# Altium project JTAGconv.PrjPcb
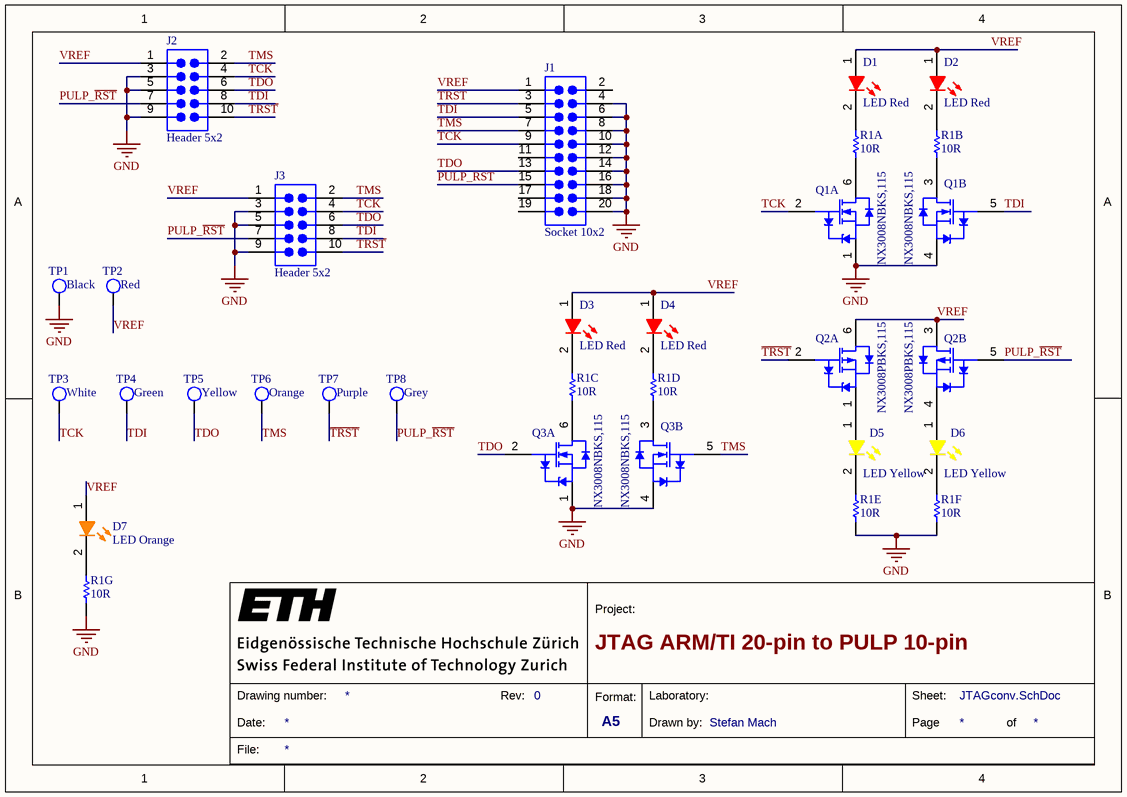
[diagram p0: JTAGconv.SchDoc]
ProjectVersion: 1.; Project Name: JTAG Plug Converter; ProjectFlavor: 1; OutFilePrefix: JTAGconv; Laboratory: Integrated Systems Laboratory (IIS); DrawnBy: Stefan Mach
1 sheet, 24 parts. Net scope: global (net labels, ports and power ports of the same name join across sheets).
Board file: JTAGconv.PcbDoc

## Sheet JTAGconv.SchDoc: JTAG ARM/TI 20-pin to PULP 10-pin
size 210 x 148 mm; DrawnBy: Stefan Mach; Organization: Integrated Systems Laboratory (IIS); Revision: 0; ProjectName: JTAG Plug Converter

### Parts
(Parts that share a designator on the sheet are numbered #1, #2 ... from top to bottom, then left to right.)
D1  LED Red  [DIOC2112X08L]
D2  LED Red  [DIOC2112X08L]
D3  LED Red  [DIOC2112X08L]
D4  LED Red  [DIOC2112X08L]
D5  LED Yellow  [DIOC2112X08L]
D6  LED Yellow  [DIOC2112X08L]
D7  LED Orange  [DIOC2112X08L]
J1  Socket 10x2  [CONN_SOCKET_10x2_RA]
J2  Header 5x2  [CONN_HDR_5x2_SHRD]
J3  Header 5x2  [CONN_HDR_5x2_50mil_SHRD]
Q1#1  NX3008NBKS,115  [NXP-SOT363_L]  (part A of 2)
Q1#2  NX3008NBKS,115  [NXP-SOT363_L]  (part B of 2)
Q2  NX3008PBKS,115  [NXP-SOT363_L]  (parts A,B of 2)
Q3#1  NX3008NBKS,115  [NXP-SOT363_L]  (part A of 2)
Q3#2  NX3008NBKS,115  [NXP-SOT363_L]  (part B of 2)
R1  10R  [CAC-80P639X159-16L]  (parts A,B,C,D,E,F,G of 8)
TP1  (no value)  [KEYSTONE-5001]
TP2  (no value)  [KEYSTONE-5000]
TP3  (no value)  [KEYSTONE-5002]
TP4  (no value)  [KEYSTONE-5116]
TP5  (no value)  [KEYSTONE-5004]
TP6  (no value)  [KEYSTONE-5003]
TP7  (no value)  [KEYSTONE-5119]
TP8  (no value)  [KEYSTONE-5118]

### Nets
GND: J1.4 J1.6 J1.8 J1.10 J1.12 J1.14 J1.16 J1.18 J1.20 J2.3 J2.5 J2.9 J3.3 J3.5 J3.9 Q1#1.1(S1) Q1#2.4(S2) Q3#1.1(S1) Q3#2.4(S2) R1.5 R1.6 R1.7 TP1.1
PULP_~{RST}: J1.15 J2.7 J3.7 Q2.5(G2) TP8.1
~{TRST}: J1.3 J2.10 J3.10 Q2.2(G1) TP7.1
TCK: J1.9 J2.4 J3.4 Q1#1.2(G1) TP3.1
TDI: J1.5 J2.8 J3.8 Q1#2.5(G2) TP4.1
TDO: J1.13 J2.6 J3.6 Q3#1.2(G1) TP5.1
TMS: J1.7 J2.2 J3.2 Q3#2.5(G2) TP6.1
VREF: D1.1(A) D2.1(A) D3.1(A) D4.1(A) D7.1(A) J1.1 J2.1 J3.1 Q2.3(D2) Q2.6(D1) TP2.1
NetD1_2: D1.2(K) R1.16
NetD2_2: D2.2(K) R1.15
NetD3_2: D3.2(K) R1.14
NetD4_2: D4.2(K) R1.13
NetD5_1: D5.1(A) Q2.1(S1)
NetD5_2: D5.2(K) R1.12
NetD6_1: D6.1(A) Q2.4(S2)
NetD6_2: D6.2(K) R1.11
NetD7_2: D7.2(K) R1.10
NetQ1#1_6: Q1#1.6(D1) R1.1
NetQ1#2_3: Q1#2.3(D2) R1.2
NetQ3#1_6: Q3#1.6(D1) R1.3
NetQ3#2_3: Q3#2.3(D2) R1.4

Not connected (* = marked no-connect by the designer): J1 2 11(2) 17(8) 19(10)

### Notes on the sheet
- Project:
- File:
- Date:
- Drawing number:
- Rev:
- Format:
- A5
- Drawn by:
- Laboratory:
- Page
- Sheet:
- of

### Library data of the parts
D1-D4 = ROHM-LED-RED-SML-211UTT86: Red LED, 0805 SMD, 2mA, 1.8V; Manufacturer: Rohm; Lens Colour: Colorless; Lens Style: Diffused,Colorless; Dominant Wavelength: 620nm; Luminous Intensity: 2.5mcd; Wavelength: 630nm; Number of LEDs: 1; Viewing Angle: 140°; Lens Transparency: Clear; Supplier 1: Digikey; Supplier Part Number 1: 511-1292-2-ND; Manufacturer Part Number: SML-211UTT86; Stock 1: 93000; Pricing 1: 3000=0.1073, 6000=0.0975, 15000=0.091, 30000=0.0878, 75000=0.0845 (USD); Mount: Surface Mount; Case/Package: 0805; Number of Pins: 2; Colour: Red; Case Code (Metric): 2012; Case Code (Imperial): 0805; Min Operating Temperature: -30°C; Max Operating Temperature: 85°C; Packaging: Tape and Reel; Forward Voltage: 1.8V; Forward Current: 2mA; Package Quantity: 3000; Illumination Colour: Red; Test Current: 2mA; Length: 2mm; Height: 0.9mm; Width: 1.25mm; Radiation Hardening: No; Lead Free: Lead Free; ComponentLink1URL: https://datasheet.ciiva.com/11774/0900766b80df3a3e-11774129.pdf; ComponentLink1Description: https://datasheet.ciiva.com/11774/0900766b80df3a3e-11774129.pdf; ComponentLink2URL: https://datasheet.ciiva.com/2115/sml-21-2115075.pdf; ComponentLink2Description: https://datasheet.ciiva.com/2115/sml-21-2115075.pdf; ComponentLink3URL: https://datasheet.ciiva.com/16293/sml-211ytt86-16293295.pdf; ComponentLink3Description: https://datasheet.ciiva.com/16293/sml-211ytt86-16293295.pdf; ComponentLink4URL: https://datasheet.ciiva.com/2115/sml-21-2115073.pdf; ComponentLink4Description: https://datasheet.ciiva.com/2115/sml-21-2115073.pdf; ComponentLink5URL: https://datasheet.ciiva.com/2115/sml-21-2115074.pdf; ComponentLink5Description: https://datasheet.ciiva.com/2115/sml-21-2115074.pdf; Supplier 2: Digikey; Supplier Part Number 2: 511-1292-6-ND; Stock 2: 94293; Pricing 2: 1=0.49, 10=0.35, 25=0.286, 100=0.2288, 250=0.193, 500=0.1645, 1000=0.1287 (USD); Supplier 3: RS Components; Supplier Part Number 3: 7007907; Stock 3: 4280; Pricing 3: 5=0.328, 25=0.24, 100=0.144, 250=0.142, 500=0.138 (EUR); Supplier 4: Digikey; Supplier Part Number 4: 511-1292-1-ND; Stock 4: 94293; Pricing 4: 1=0.49, 10=0.35, 25=0.286, 100=0.2288, 250=0.193, 500=0.1645, 1000=0.1287 (USD); Supplier 5: Verical; Supplier Part Number 5: SML-211UTT86; Stock 5: 3373; Pricing 5: 70=0.3839, 100=0.2371, 500=0.2101, 1000=0.1859 (USD); Supplier 6: Chip One Stop Japan; Supplier Part Number 6: C1S625900634159; Stock 6: 3373; Pricing 6: 10=57.8, 50=41, 100=35.7, 500=19.5, 1000=15.1, 3000=14.7, 10=0.287, 50=0.285, 100=0.176, 500=0.156, 1000=0.138, 3000=0.134, 10=2.59, 100=1.4, 1000=1.1, 3000=1.07 (JPY); Supplier 7: Future Electronics; Supplier Part Number 7: 7057434; Stock 7: 3000; Pricing 7: 3000=0.104 (USD); Supplier 8: Mouser; Supplier Part Number 8: 755-SML-211UTT86; Stock 8: 8950; Pricing 8: 1=0.38, 10=0.288, 50=0.288, 100=0.156, 1000=0.117, 10000=0.095 (USD); Supplier 9: Avnet Europe; Supplier Part Number 9: SML-211UTT86; Stock 9: 0; Pricing 9: 3000=0.2086, 6000=0.1622, 12000=0.1327, 18000=0.1123, 30000=0.1043 (EUR); Supplier 10: Chip One Stop Global; Supplier Part Number 10: C1S625900634159; Stock 10: 3000; Pricing 10: 50=89.3, 500=84.8, 1000=78.8, 50=0.834, 500=0.792, 1000=0.736, 50=6.65, 500=6.31, 1000=5.86 (JPY); Supplier 11: Future Electronics; Supplier Part Number 11: 6473904; Stock 11: 0; Pricing 11: 3000=0.0898, 9000=0.0869 (USD); Supplier 12: Future Electronics; Supplier Part Number 12: 5988308; Stock 12: 0; Pricing 12: 1=0.1, 400=0.0975 (USD); Supplier 13: Allied Electronics; Supplier Part Number 13: 70522030; Stock 13: 5; Pricing 13: 1=0.67, 100=0.59, 250=0.53, 500=0.49 (USD); Supplier 14: Avnet; Supplier Part Number 14: SML-211UTT86; Stock 14: 0; Pricing 14: 3000=0.1029, 6000=0.0964, 12000=0.0908, 18000=0.0858, 30000=0.0834 (USD); Supplier 15: Avnet Asia; Supplier Part Number 15: SML-211UTT86; Stock 15: 0; Pricing 15: 3000=0.1051, 6000=0.0956, 12000=0.0924, 18000=0.0892, 30000=0.088 (USD); Supplier 16: LTL Group; Supplier Part Number 16: SML-211UTT86; Stock 16: 2800; Supplier 17: Quest; Supplier Part Number 17: SML-211UTT86; Stock 17: 2840; Supplier 18: Future Electronics; Supplier Part Number 18: SML-211UTT86; Stock 18: 0; Pricing 18: 3000=0.104, 6000=0.0956, 9000=0.0936 (USD); Supplier 19: Farnell; Supplier Part Number 19: 1685056; Stock 19: 0; Pricing 19: 1=0.688, 10=0.319, 100=0.238, 250=0.209, 500=0.188, 2000=0.167, 4000=0.15, 20000=0.131 (EUR); REACH SVHC: No SVHC; ComponentLink6URL: https://datasheet.ciiva.com/8028/1694508-8028242.pdf; ComponentLink6Description: https://datasheet.ciiva.com/8028/1694508-8028242.pdf; Supplier 20: element14 APAC; Supplier Part Number 20: 1685056; Stock 20: 102; Supplier 21: Newark; Supplier Part Number 21: 40P3314; Stock 21: 0; Supplier 22: Epart123; Supplier Part Number 22: SML-211UTT86K; Stock 22: 6000; Pricing 22: 3000=0.072, 10000=0.072 (USD); Supplier 23: Farnell; Supplier Part Number 23: 1685056RL; Stock 23: 15873; Pricing 23: 1=0.43, 100=0.189, 2000=0.0918, 4000=0.0826, 20000=0.0744 (GBP)
D5 D6 = ROHM-LED-YELLOW-SML-211YTT86: Yellow LED, 0805 SMD, 2mA, 1.8V; Manufacturer: Rohm; Manufacturer Part Number: SML-211UTT86; Colour: Red; Lens Colour: Colorless; Lens Style: Diffused,Colorless; Dominant Wavelength: 620nm; Luminous Intensity: 2.5mcd; Wavelength: 630nm; Number of LEDs: 1; Viewing Angle: 140°; Lens Transparency: Clear; Mount: Surface Mount; Case/Package: 0805; Number of Pins: 2; Case Code (Metric): 2012; Case Code (Imperial): 0805; Min Operating Temperature: -30°C; Max Operating Temperature: 85°C; Packaging: Tape and Reel; Forward Voltage: 1.8V; Forward Current: 2mA; Package Quantity: 3000; Illumination Colour: Red; Test Current: 2mA; Length: 2mm; Height: 0.9mm; Width: 1.25mm; Radiation Hardening: No; Lead Free: Lead Free; ComponentLink1URL: https://datasheet.ciiva.com/11774/0900766b80df3a3e-11774129.pdf; ComponentLink1Description: https://datasheet.ciiva.com/11774/0900766b80df3a3e-11774129.pdf; ComponentLink2URL: https://datasheet.ciiva.com/2115/sml-21-2115075.pdf; ComponentLink2Description: https://datasheet.ciiva.com/2115/sml-21-2115075.pdf; ComponentLink3URL: https://datasheet.ciiva.com/16293/sml-211ytt86-16293295.pdf; ComponentLink3Description: https://datasheet.ciiva.com/16293/sml-211ytt86-16293295.pdf; ComponentLink4URL: https://datasheet.ciiva.com/2115/sml-21-2115073.pdf; ComponentLink4Description: https://datasheet.ciiva.com/2115/sml-21-2115073.pdf; ComponentLink5URL: https://datasheet.ciiva.com/2115/sml-21-2115074.pdf; ComponentLink5Description: https://datasheet.ciiva.com/2115/sml-21-2115074.pdf; REACH SVHC: No SVHC; ComponentLink6URL: https://datasheet.ciiva.com/8028/1694508-8028242.pdf; ComponentLink6Description: https://datasheet.ciiva.com/8028/1694508-8028242.pdf; Supplier 1: Digikey; Supplier Part Number 1: 511-1293-2-ND; Stock 1: 12000; Pricing 1: 3000=0.1073, 6000=0.0975, 15000=0.091, 30000=0.0878, 75000=0.0845 (USD); ComponentLink7URL: https://datasheet.ciiva.com/11774/0900766b80df3a3e-11774886.pdf; ComponentLink7Description: https://datasheet.ciiva.com/11774/0900766b80df3a3e-11774886.pdf; ComponentLink8URL: https://datasheet.ciiva.com/16392/sml-211ytt86-16392987.pdf; ComponentLink8Description: https://datasheet.ciiva.com/16392/sml-211ytt86-16392987.pdf; ComponentLink9URL: https://datasheet.ciiva.com/2111/sml-21-2111285.pdf; ComponentLink9Description: https://datasheet.ciiva.com/2111/sml-21-2111285.pdf; ComponentLink10URL: https://datasheet.ciiva.com/2111/sml-21-2111283.pdf; ComponentLink10Description: https://datasheet.ciiva.com/2111/sml-21-2111283.pdf; ComponentLink11URL: https://datasheet.ciiva.com/2111/sml-21-2111284.pdf; ComponentLink11Description: https://datasheet.ciiva.com/2111/sml-21-2111284.pdf; Supplier 2: Digikey; Supplier Part Number 2: 511-1293-6-ND; Stock 2: 13553; Pricing 2: 1=0.49, 10=0.35, 25=0.286, 100=0.2288, 250=0.193, 500=0.1645, 1000=0.1287 (USD); Supplier 3: Farnell; Supplier Part Number 3: 1685057RL; Stock 3: 12289; Pricing 3: 900=0.0963, 3000=0.0922, 9000=0.0904 (GBP); ComponentLink12URL: https://datasheet.ciiva.com/8028/90860-8028248.pdf; ComponentLink12Description: https://datasheet.ciiva.com/8028/90860-8028248.pdf; ComponentLink13URL: https://datasheet.ciiva.com/8028/90860-8028245.pdf; ComponentLink13Description: https://datasheet.ciiva.com/8028/90860-8028245.pdf; Supplier 4: element14 APAC; Supplier Part Number 4: 1685057; Stock 4: 60; Supplier 5: Newark; Supplier Part Number 5: 40P3315; Stock 5: 0; Supplier 6: Avnet Europe; Supplier Part Number 6: SML211YTT86K; Stock 6: 0; Supplier 7: Farnell; Supplier Part Number 7: 1685057; Stock 7: 0; Pricing 7: 1=1.07, 10=0.502, 100=0.369, 250=0.327, 500=0.291, 900=0.261, 3000=0.232, 9000=0.206 (EUR); Supplier 8: Future Electronics; Supplier Part Number 8: SML-211YTT86; Stock 8: 6000; Pricing 8: 3000=0.104, 6000=0.0956, 9000=0.0936 (USD); Supplier 9: Quest; Supplier Part Number 9: SML-211YTT86; Stock 9: 2989; Pricing 9: 1=0.276, 19=0.207, 49=0.1725, 291=0.138, 1450=0.1035 (USD); Supplier 10: LTL Group; Supplier Part Number 10: SML-211YTT86; Stock 10: 0; Pricing 10: 2238=2238 (USD); Supplier 11: Avnet; Supplier Part Number 11: SML-211YTT86; Stock 11: 0; Pricing 11: 3000=0.1029, 6000=0.0964, 12000=0.0908, 18000=0.0858, 30000=0.0834 (USD); Supplier 12: Future Electronics; Supplier Part Number 12: 8894297; Stock 12: 0; Pricing 12: 1=0.1, 400=0.0975 (USD); Supplier 13: Future Electronics; Supplier Part Number 13: 6809040; Stock 13: 0; Pricing 13: 3000=0.0898, 9000=0.0869 (USD); Supplier 14: Avnet Europe; Supplier Part Number 14: SML-211YTT86; Stock 14: 0; Pricing 14: 3000=0.2086, 6000=0.1622, 12000=0.1327, 18000=0.1123, 30000=0.1043 (EUR); Supplier 15: Chip One Stop Global; Supplier Part Number 15: C1S625900634186; Stock 15: 3000; Pricing 15: 50=89.3, 500=84.8, 1000=78.8, 50=0.834, 500=0.792, 1000=0.736, 50=6.65, 500=6.31, 1000=5.86 (JPY); Supplier 16: Chip One Stop Japan; Supplier Part Number 16: C1S625900634186; Stock 16: 11890; Pricing 16: 10=33.1, 50=32.2, 100=25.8, 500=18.5, 1000=15.1, 3000=14.7, 10=0.272, 50=0.27, 100=0.176, 500=0.155, 1000=0.138, 3000=0.134, 10=2.46, 50=2.26, 100=1.39, 500=1.29, 1000=1.1, 3000=1.07 (JPY); Supplier 17: Mouser; Supplier Part Number 17: 755-SML-211YTT86; Stock 17: 2680; Pricing 17: 1=0.38, 10=0.288, 50=0.288, 100=0.156, 1000=0.117, 10000=0.095 (USD); Supplier 18: Digikey; Supplier Part Number 18: 511-1293-1-ND; Stock 18: 13553; Pricing 18: 1=0.49, 10=0.35, 25=0.286, 100=0.2288, 250=0.193, 500=0.1645, 1000=0.1287 (USD); Supplier 19: Verical; Supplier Part Number 19: SML-211YTT86; Stock 19: 11890; Pricing 19: 74=0.3622, 100=0.2361, 500=0.208, 1000=0.1851 (USD); Supplier 20: RS Components; Supplier Part Number 20: 7007900; Stock 20: 1739; Pricing 20: 5=0.318, 25=0.232, 100=0.14, 250=0.138, 500=0.134 (EUR)
D7 = ROHM-LED-ORANGE-SML-211DTT86: Orange LED, 0805 SMD, 2mA, 1.8V; Manufacturer: Rohm; Manufacturer Part Number: SML-211UTT86; Colour: Red; Lens Colour: Colorless; Lens Style: Diffused,Colorless; Dominant Wavelength: 620nm; Luminous Intensity: 2.5mcd; Wavelength: 630nm; Number of LEDs: 1; Viewing Angle: 140°; Lens Transparency: Clear; Mount: Surface Mount; Case/Package: 0805; Number of Pins: 2; Case Code (Metric): 2012; Case Code (Imperial): 0805; Min Operating Temperature: -30°C; Max Operating Temperature: 85°C; Packaging: Tape and Reel; Forward Voltage: 1.8V; Forward Current: 2mA; Package Quantity: 3000; Illumination Colour: Red; Test Current: 2mA; Length: 2mm; Height: 0.9mm; Width: 1.25mm; Radiation Hardening: No; Lead Free: Lead Free; ComponentLink1URL: https://datasheet.ciiva.com/11774/0900766b80df3a3e-11774129.pdf; ComponentLink1Description: https://datasheet.ciiva.com/11774/0900766b80df3a3e-11774129.pdf; ComponentLink2URL: https://datasheet.ciiva.com/2115/sml-21-2115075.pdf; ComponentLink2Description: https://datasheet.ciiva.com/2115/sml-21-2115075.pdf; ComponentLink3URL: https://datasheet.ciiva.com/16293/sml-211ytt86-16293295.pdf; ComponentLink3Description: https://datasheet.ciiva.com/16293/sml-211ytt86-16293295.pdf; ComponentLink4URL: https://datasheet.ciiva.com/2115/sml-21-2115073.pdf; ComponentLink4Description: https://datasheet.ciiva.com/2115/sml-21-2115073.pdf; ComponentLink5URL: https://datasheet.ciiva.com/2115/sml-21-2115074.pdf; ComponentLink5Description: https://datasheet.ciiva.com/2115/sml-21-2115074.pdf; REACH SVHC: No SVHC; ComponentLink6URL: https://datasheet.ciiva.com/8028/1694508-8028242.pdf; ComponentLink6Description: https://datasheet.ciiva.com/8028/1694508-8028242.pdf; ComponentLink7URL: https://datasheet.ciiva.com/11774/0900766b80df3a3e-11774886.pdf; ComponentLink7Description: https://datasheet.ciiva.com/11774/0900766b80df3a3e-11774886.pdf; ComponentLink8URL: https://datasheet.ciiva.com/16392/sml-211ytt86-16392987.pdf; ComponentLink8Description: https://datasheet.ciiva.com/16392/sml-211ytt86-16392987.pdf; ComponentLink9URL: https://datasheet.ciiva.com/2111/sml-21-2111285.pdf; ComponentLink9Description: https://datasheet.ciiva.com/2111/sml-21-2111285.pdf; ComponentLink10URL: https://datasheet.ciiva.com/2111/sml-21-2111283.pdf; ComponentLink10Description: https://datasheet.ciiva.com/2111/sml-21-2111283.pdf; ComponentLink11URL: https://datasheet.ciiva.com/2111/sml-21-2111284.pdf; ComponentLink11Description: https://datasheet.ciiva.com/2111/sml-21-2111284.pdf; ComponentLink12URL: https://datasheet.ciiva.com/8028/90860-8028248.pdf; ComponentLink12Description: https://datasheet.ciiva.com/8028/90860-8028248.pdf; ComponentLink13URL: https://datasheet.ciiva.com/8028/90860-8028245.pdf; ComponentLink13Description: https://datasheet.ciiva.com/8028/90860-8028245.pdf; Supplier 1: Avnet; Supplier Part Number 1: SML-211DTT86K; Stock 1: 0; ComponentLink14URL: https://datasheet.ciiva.com/8028/90860-8028240.pdf; ComponentLink14Description: https://datasheet.ciiva.com/8028/90860-8028240.pdf; ComponentLink15URL: https://datasheet.ciiva.com/8028/90860-8028237.pdf; ComponentLink15Description: https://datasheet.ciiva.com/8028/90860-8028237.pdf; Supplier 2: Digikey; Supplier Part Number 2: 511-1291-2-ND; Stock 2: 33000; Pricing 2: 3000=0.1073, 6000=0.0975, 15000=0.091, 30000=0.0878, 75000=0.0845 (USD); ComponentLink16URL: https://datasheet.ciiva.com/16219/sml-211ytt86-16219080.pdf; ComponentLink16Description: https://datasheet.ciiva.com/16219/sml-211ytt86-16219080.pdf; ComponentLink17URL: https://datasheet.ciiva.com/11773/0900766b80df3a3e-11773627.pdf; ComponentLink17Description: https://datasheet.ciiva.com/11773/0900766b80df3a3e-11773627.pdf; ComponentLink18URL: https://datasheet.ciiva.com/2111/sml-21-2111286.pdf; ComponentLink18Description: https://datasheet.ciiva.com/2111/sml-21-2111286.pdf; ComponentLink19URL: https://datasheet.ciiva.com/2111/sml-21-2111287.pdf; ComponentLink19Description: https://datasheet.ciiva.com/2111/sml-21-2111287.pdf; ComponentLink20URL: https://datasheet.ciiva.com/2111/sml-21-2111288.pdf; ComponentLink20Description: https://datasheet.ciiva.com/2111/sml-21-2111288.pdf; Supplier 3: Avnet; Supplier Part Number 3: SML-211DTT86; Stock 3: 0; Pricing 3: 3000=0.1029, 6000=0.0964, 12000=0.0908, 18000=0.0858, 30000=0.0834 (USD); Supplier 4: Allied Electronics; Supplier Part Number 4: 70522027; Stock 4: 50; Pricing 4: 1=0.42, 200=0.37, 500=0.33, 1000=0.31 (USD); Supplier 5: Quest; Supplier Part Number 5: SML-211DTT86; Stock 5: 587; Supplier 6: Newark; Supplier Part Number 6: 40P3313; Stock 6: 1089; Pricing 6: 1=0.391, 10=0.289, 100=0.248, 250=0.214, 500=0.184, 1000=0.143, 2500=0.127, 5000=0.107 (USD); Supplier 7: Farnell; Supplier Part Number 7: 1685055RL; Stock 7: 6606; Pricing 7: 1=0.38, 10=0.222, 100=0.163, 2000=0.0792, 4000=0.0713, 20000=0.0642 (GBP); Supplier 8: Future Electronics; Supplier Part Number 8: SML-211DTT86; Stock 8: 0; Pricing 8: 3000=0.104, 6000=0.0956, 9000=0.0936 (USD); Supplier 9: Digikey; Supplier Part Number 9: 511-1291-1-ND; Stock 9: 34587; Pricing 9: 1=0.49, 10=0.35, 25=0.286, 100=0.2288, 250=0.193, 500=0.1645, 1000=0.1287 (USD); Supplier 10: RS Components; Supplier Part Number 10: 7007897; Stock 10: 1709; Pricing 10: 10=0.245, 50=0.196, 200=0.145, 500=0.122, 1000=0.113 (EUR); Supplier 11: Digikey; Supplier Part Number 11: 511-1291-6-ND; Stock 11: 34587; Pricing 11: 1=0.49, 10=0.35, 25=0.286, 100=0.2288, 250=0.193, 500=0.1645, 1000=0.1287 (USD); Supplier 12: Verical; Supplier Part Number 12: SML-211DTT86; Stock 12: 2869; Pricing 12: 70=0.3793, 100=0.2342, 500=0.2063, 1000=0.1836 (USD); Supplier 13: Chip One Stop Japan; Supplier Part Number 13: C1S625900507174; Stock 13: 2869; Pricing 13: 10=41.7, 50=34, 100=29.5, 500=25.3, 1000=23.1, 10=0.287, 50=0.285, 100=0.176, 500=0.156, 1000=0.138, 10=2.91, 50=2.38, 100=1.9, 500=1.36, 1000=1.1 (JPY); Supplier 14: Mouser; Supplier Part Number 14: 755-SML-211DTT86; Stock 14: 0; Pricing 14: 1=0.38, 10=0.288, 50=0.288, 100=0.156, 1000=0.117, 10000=0.095 (USD); Supplier 15: Future Electronics; Supplier Part Number 15: 6940829; Stock 15: 0; Pricing 15: 1=0.1, 400=0.0975 (USD); Supplier 16: Avnet Europe; Supplier Part Number 16: SML-211DTT86; Stock 16: 0; Supplier 17: Future Electronics; Supplier Part Number 17: 7062953; Stock 17: 0; Pricing 17: 3000=0.0898, 9000=0.0869 (USD); Supplier 18: Avnet Asia; Supplier Part Number 18: SML-211DTT86; Stock 18: 0; Pricing 18: 3000=0.1029 (USD); Supplier 19: SPEC; Supplier Part Number 19: SML-211DTT86; Stock 19: 2900; Supplier 20: Farnell; Supplier Part Number 20: 1685055; Stock 20: 0; Pricing 20: 1=0.722, 10=0.333, 100=0.245, 250=0.213, 500=0.191, 2000=0.17, 4000=0.153, 20000=0.134 (EUR); Supplier 21: element14 APAC; Supplier Part Number 21: 1685055; Stock 21: 0
J1 = CONN-SOCKET-F-10x2-RA: Female Socket, 10x2, Pitch 2.54mm, 20-Pin, Right-Angle; Manufacturer: Sullins; Manufacturer Part Number: SFH11-PBPC-D10-RA-BK; Number of Positions: 20; Connector Type: Socket,Header; Pitch: 0.1inch; Supplier 1: Digikey; Stock 1: 3527; Pricing 1: 1=1.67, 10=1.38, 25=1.2936, 50=1.15, 100=1.035, 250=0.9545, 500=0.8625, 1000=0.7648, 2500=0.7331 (USD); Colour: Black; Contact Plating: Gold; Package Quantity: 1; Number of Rows: 2; Packaging: Tray; Termination: Solder; Row Spacing: 0.1inch; Lead Free: Lead Free; ComponentLink1URL: https://datasheet.ciiva.com/16226/sfh11-pbpc-d10-ra-bk-16226946.pdf; ComponentLink1Description: https://datasheet.ciiva.com/16226/sfh11-pbpc-d10-ra-bk-16226946.pdf; ComponentLink2URL: https://datasheet.ciiva.com/754/sfh11-pxxc-dxx-ra-xx11161-c-754566.pdf; ComponentLink2Description: https://datasheet.ciiva.com/754/sfh11-pxxc-dxx-ra-xx11161-c-754566.pdf; Supplier 2: Future Electronics; Stock 2: 0; Pricing 2: 1080=0.875 (USD); Supplier 3: Future Electronics; Stock 3: 0; Pricing 3: 10=1.5, 25=1.42, 75=1.25, 200=1.03, 500=0.875 (USD); Supplier Part Number 1: S9205-ND; Supplier Part Number 2: SFH11-PBPC-D10-RA-BK; Supplier Part Number 3: 2723161
J2 = CONN-HEADER-M-5x2-SHRD: Male Header, 5x2, Pitch 2.54mm, 10-Pin, Shrouded; Manufacturer: On-Shore Technology; Manufacturer Part Number: 302-S101; Number of Positions: 10; Connector Type: Male Pin; Pitch: 0.1inch; Colour: Black; Supplier 1: Arrow; Supplier Part Number 1: 302-S101; Stock 1: 10; Pricing 1: 1=0.252, 10=0.2343, 50=0.1686, 100=0.1605, 250=0.1426, 500=0.1346, 1000=0.111, 2500=0.1004, 5000=0.0932 (USD); Case/Package: 100; Contact Plating: Gold; Number of Rows: 2; Packaging: Tray; Termination: Solder; Row Spacing: 0.1inch; ComponentLink1URL: https://datasheet.ciiva.com/732/302-sxxx-732946.pdf; ComponentLink1Description: https://datasheet.ciiva.com/732/302-sxxx-732946.pdf; Supplier 2: Digikey; Supplier Part Number 2: ED1543-ND; Stock 2: 46867; Pricing 2: 1=0.28, 10=0.263, 50=0.1912, 100=0.1838, 250=0.165, 500=0.1575, 1000=0.1313, 2500=0.12, 5000=0.1125 (USD); Supplier 3: Peerless Electronic Supplies; Supplier Part Number 3: 302-S101; Pricing 3: 1=0.25 (USD)
J3 = CONN-HEADER-M-5x2-50mil-shrd: Male Header, 5x2, Pitch 1.27mm, 10-Pin, Shrouded; Manufacturer: CNC Tech; Manufacturer Part Number: 3220-10-0100-00; Number of Positions: 10; Connector Type: Header, Shrouded; Pitch: 0.050" (1.27mm); Minimum Quantity: Male Pin; Mating Products: 1175-1645-ND / - IDC SOCKET 0.050 10 POS / 3230-10-0102-00-ND / - IDC SOCKET 0.050 10 POS / 1175-1646-ND / - IDC SOCKET 0.050 10 POS / 3230-10-0104-00-ND / - IDC SOCKET 0.050 10 POS; Dynamic Catalog: CNC Tech, 0.050" (1.27mm); Number of Positions Loaded: All; Mating: 3230-10-0102-00-ND / - IDC SOCKET 0.050 10 POS / 1175-1645-ND / - IDC SOCKET 0.050 10 POS; Other Names: 1175-1627 / 3220-10-0100-00-ND; Supplier 1: Digikey; Supplier Part Number 1: 1175-1627-ND; Stock 1: 66468; Pricing 1: 1=0.48, 10=0.45, 50=0.36, 100=0.345, 250=0.315, 500=0.3, 1000=0.2475, 2500=0.225, 5000=0.2175 (USD); Number of Rows: 2; Packaging: Tray; Termination: Solder; Row Spacing: 0.050" (1.27mm); ComponentLink1URL: https://datasheet.ciiva.com/18655/3220-xx-0100-00-18655342.pdf; ComponentLink1Description: https://datasheet.ciiva.com/18655/3220-xx-0100-00-18655342.pdf; Supplier 2: Digikey; Supplier Part Number 2: 3220-10-0100-00-ND; Stock 2: 0; Pricing 2: 6720=0.2045 (USD); Quantity Available: Tray; Standard Package: 3,200; Category: Connectors, Interconnects; Family: Rectangular Connectors - Headers, Male Pins; Contact Type: Male Pin; Mounting Type: Through Hole; Contact Finish: Gold; Contact Finish Thickness: Flash; Online Catalog: CNC Tech, 0.050" (1.27mm)
Q1#1 Q1#2 Q3#1 Q3#2 = CMP-1259-00111-1: Dual N-Channel Trench MOSFET, 30 V, 0.35 A, -55 to 150 degC, 6-Pin SOT363, Tape and Reel; Manufacturer: NXP Semiconductors; VDS [max] (V): 30; ID [max] (A): 0.35; VGSth [typ] (V): 0.9; IDM [max] (A): 1.4; Automotive Qualified: Y; Channel Type: N; Packing: Tape & Reel; Mounting Technology: Surface Mount; ComponentLink3Description: Package Specification; ComponentLink2URL: http://www.nxp.com/documents/data_sheet/NX3008NBKS.pdf; DatasheetVersion: Rev. 1; ComponentLink2Description: Datasheet; Code_JEITA: SC-88; PackageReference: SOT363; PackageVersion: 06-03-16, 03/2006; ComponentLink1URL: http://www.nxp.com/; ComponentLink3URL: http://www.nxp.com/documents/outline_drawing/sot363_po.pdf; ComponentLink1Description: Manufacturer URL; PackageDescription: 6-Pin Small Outline Transistor Package, Body 2 x 1.25 mm, Pitch 0.65 mm; PartNumber: NX3008NBKS,115; PartId: 1
Q2 = CMP-1259-00112-1: Dual P-Channel Trench MOSFET, -30 V, -0.2 A, -55 to 150 degC, 6-Pin SOT363, Tape and Reel; Manufacturer: NXP Semiconductors; Packing: Tape & Reel; Automotive Qualified: Y; Channel Type: P; IDM [max] (A): -0.8; VGSth [typ] (V): -0.9; ID [max] (A): -0.2; ComponentLink2Description: Datasheet; ComponentLink1Description: Manufacturer URL; ComponentLink2URL: http://www.nxp.com/documents/data_sheet/NX3008PBKS.pdf; ComponentLink3URL: http://www.nxp.com/documents/outline_drawing/sot363_po.pdf; ComponentLink1URL: http://www.nxp.com/; PackageReference: SOT363; ComponentLink3Description: Package Specification; VDS [max] (V): -30; Mounting Technology: Surface Mount; PackageDescription: 6-Pin Small Outline Transistor Package, Body 2 x 1.25 mm, Pitch 0.65 mm; DatasheetVersion: Rev. 1; Code_JEITA: SC-88; PartNumber: NX3008PBKS,115; PackageVersion: 06-03-16, 03/2006; PartId: 1
R1 = RES_ARRAY_0603_8x_10Ohm: 10 Ohm ±5% 62.5mW Power Per Element Isolated Resistor Network/Array; Manufacturer: CTS; Manufacturer Part Number: 742C163100JP; Number of Elements: 8; Power Dissipation: 63mW; Working Voltage: 50V; Temperature Coefficient: 200ppm/°C; Supplier 1: Digikey; Supplier Part Number 1: 742C163100JPTR-ND; Stock 1: 8000; Pricing 1: 4000=0.0693, 8000=0.0624, 12000=0.061, 28000=0.0589, 100000=0.0572 (USD); Mount: Surface Mount; Case/Package: Molded; Number of Pins: 16; Number of Terminals: 16; Contact Plating: Tin; Min Operating Temperature: -55°C; Max Operating Temperature: 125°C; Resistance: 10R; Tolerance: 5%; Packaging: Tape and Reel; Number of Resistors: 8; Termination: Concave; Military Standard: Not; Composition: Thick Film; Package Quantity: 4000; Circuit Type: Isolated; Power Per Element: 62.5mW; Length: 6.4mm; Height: 0.028inch; Terminal Pitch: 0.8mm; Depth: 1.6mm; Width: 0.063inch; Lead Free: Lead Free; ComponentLink1URL: https://datasheet.ciiva.com/16402/008-0335-0-16402366.pdf; ComponentLink1Description: https://datasheet.ciiva.com/16402/008-0335-0-16402366.pdf; ComponentLink2URL: https://datasheet.ciiva.com/2708/008-0335-0-2708080.pdf; ComponentLink2Description: https://datasheet.ciiva.com/2708/008-0335-0-2708080.pdf; Supplier 2: Digikey; Supplier Part Number 2: 742C163100JPDKR-ND; Stock 2: 8575; Pricing 2: 1=0.46, 10=0.351, 25=0.2668, 50=0.1982, 100=0.1474, 250=0.1245, 500=0.1067, 1000=0.0813 (USD); Supplier 3: Mouser; Supplier Part Number 3: 774-742C163100JP; Stock 3: 3120; Pricing 3: 1=0.47, 10=0.361, 50=0.361, 100=0.11, 1000=0.084, 10000=0.063 (USD); Supplier 4: Arrow; Supplier Part Number 4: 742C163100JP; Stock 4: 796; Pricing 4: 4000=0.1865, 8000=0.1661, 12000=0.1616, 28000=0.156 (USD); Supplier 5: Future Electronics; Supplier Part Number 5: 4272464; Stock 5: 0; Pricing 5: 4000=0.112, 8000=0.064 (USD); Supplier 6: Digikey; Supplier Part Number 6: 742C163100JPCT-ND; Stock 6: 8575; Pricing 6: 1=0.46, 10=0.351, 25=0.2668, 50=0.1982, 100=0.1474, 250=0.1245, 500=0.1067, 1000=0.0813 (USD); Supplier 7: Avnet; Supplier Part Number 7: 742C163100JP; Stock 7: 0; Pricing 7: 4000=0.0674, 8000=0.0565, 16000=0.0537, 24000=0.0511, 40000=0.0499 (USD); Supplier 8: Digikey; Supplier Part Number 8: 742C163100JP-ND; Stock 8: 0; Supplier 9: Future Electronics; Supplier Part Number 9: 742C163100JP; Stock 9: 0; Pricing 9: 4000=0.112, 8000=0.064 (USD); Supplier 10: Verical; Supplier Part Number 10: 742C163100JPTR; Stock 10: 2003; Pricing 10: 501=0.1292 (USD); Radiation Hardening: No; ComponentLink3URL: https://datasheet.ciiva.com/26820/getdatasheetpartid-91932-26820412.pdf; ComponentLink3Description: https://datasheet.ciiva.com/26820/getdatasheetpartid-91932-26820412.pdf; Supplier 11: Arrow; Supplier Part Number 11: 742C163100JPTR**MULT1; Stock 11: 2003; Pricing 11: 1=0.2879, 10=0.2314, 25=0.2171, 100=0.1566, 250=0.1464, 500=0.13 (USD); Supplier 12: Arrow; Supplier Part Number 12: 742C163100JPTR; Stock 12: 5873; Pricing 12: 10=1, 100=0.17, 500=0.1 (USD)
TP1 = KEYS-TESTPOINT-5001: PC Test Point Miniature, Through Hole; Manufacturer: Keystone Electronics Corp.; Man. Product No.: 5001; Color: Black; Supplier 1: Mouser; Supplier 2: Farnell; Supplier 3: Digi-Key; Supplier 4: Farnell; Supplier 5: Newark; Supplier 6: Newark; Supplier Part Number 1: 534-5001; Supplier Part Number 2: 1463077; Supplier Part Number 3: 36-5001-ND; Supplier Part Number 4: 2301278; Supplier Part Number 5: 52F7278; Supplier Part Number 6: 62W5135; ComponentLink1Description: Datasheet; ComponentLink1URL: http://www.keyelco.com/product-pdf.cfm?p=1309
TP2 = KEYS-TESTPOINT-5000: PC Test Point Miniature, Through Hole; Manufacturer: Keystone Electronics Corp.; Man. Product No.: 5000; Color: Red; Supplier 1: Digi-Key; Supplier 2: Farnell; Supplier 3: Mouser; Supplier 4: Farnell; Supplier 5: Newark; Supplier 6: Newark; Supplier Part Number 1: 36-5000-ND; Supplier Part Number 2: 1463076; Supplier Part Number 3: 534-5000; Supplier Part Number 4: 2250281; Supplier Part Number 5: 07J9695; Supplier Part Number 6: 52F7277; ComponentLink1Description: Datasheet; ComponentLink1URL: http://www.keyelco.com/product-pdf.cfm?p=1309
TP3 = KEYS-TESTPOINT-5002: PC Test Point Miniature, Through Hole; Manufacturer: Keystone Electronics Corp.; Man. Product No.: 5002; Color: White; Supplier 1: Newark; Supplier 2: Digi-Key; Supplier 3: Farnell; Supplier 4: Newark; Supplier Part Number 1: 62W5136; Supplier Part Number 2: 36-5002-ND; Supplier Part Number 3: 2301279; Supplier Part Number 4: 52F7279; ComponentLink1Description: Datasheet; ComponentLink1URL: http://www.keyelco.com/product-pdf.cfm?p=1309
TP4 = KEYS-TESTPOINT-5116: PC Test Point Miniature, Through Hole; Manufacturer: Keystone Electronics Corp.; Man. Product No.: 5116; Color: Green; Supplier 1: Newark; Supplier 2: Digi-Key; Supplier 3: Farnell; Supplier 4: Mouser; Supplier Part Number 1: 95M2478; Supplier Part Number 2: 36-5116-ND; Supplier Part Number 3: 2501301; Supplier Part Number 4: 534-5116; ComponentLink1URL: http://keyelco.com/userAssets/file/M65p56.pdf; ComponentLink1Description: Datasheet
TP5 = KEYS-TESTPOINT-5004: PC Test Point Miniature, Through Hole; Manufacturer: Keystone Electronics Corp.; Man. Product No.: 5004; Color: Yellow; Supplier 1: Farnell; Supplier 2: Newark; Supplier 3: Allied; Supplier 4: Digi-Key; Supplier 5: Allied; Supplier 6: Farnell; Supplier 7: Mouser; Supplier 8: Newark; Supplier Part Number 1: 2301281; Supplier Part Number 2: 52F7281; Supplier Part Number 3: 70182994; Supplier Part Number 4: 36-5004-ND; Supplier Part Number 5: 70799415; Supplier Part Number 6: 1533290; Supplier Part Number 7: 534-5004; Supplier Part Number 8: 62W5138; ComponentLink1Description: Datasheet; ComponentLink1URL: http://www.keyelco.com/product-pdf.cfm?p=1309
TP6 = KEYS-TESTPOINT-5003: PC Test Point Miniature, Through Hole; Manufacturer: Keystone Electronics Corp.; Man. Product No.: 5003; Color: Orange; ComponentLink1Description: Datasheet; ComponentLink1URL: http://www.keyelco.com/product-pdf.cfm?p=1309; Supplier 1: Newark; Supplier Part Number 1: 62W5137; Supplier 2: Digi-Key; Supplier Part Number 2: 36-5003-ND; Supplier 3: Allied; Supplier Part Number 3: 70182828; Supplier 4: Allied; Supplier Part Number 4: 70799414; Supplier 5: Newark; Supplier Part Number 5: 52F7280
TP7 = KEYS-TESTPOINT-5119: PC Test Point Miniature, Through Hole; Manufacturer: Keystone Electronics Corp.; Man. Product No.: 5119; Color: Purple; ComponentLink1URL: http://keyelco.com/userAssets/file/M65p56.pdf; ComponentLink1Description: Datasheet; Supplier 1: Digi-Key; Supplier Part Number 1: 36-5119-ND; Supplier 2: Newark; Supplier Part Number 2: 95M2481; Supplier 3: Allied; Supplier Part Number 3: 70182273
TP8 = KEYS-TESTPOINT-5118: PC Test Point Miniature, Through Hole; Manufacturer: Keystone Electronics Corp.; Man. Product No.: 5118; Color: Grey; ComponentLink1URL: http://keyelco.com/userAssets/file/M65p56.pdf; ComponentLink1Description: Datasheet; Supplier 1: Newark; Supplier Part Number 1: 95M2480; Supplier 2: Allied; Supplier Part Number 2: 70182272; Supplier 3: Digi-Key; Supplier Part Number 3: 36-5118-ND